# EAGLE design winder (EAGLE 7.3.0)
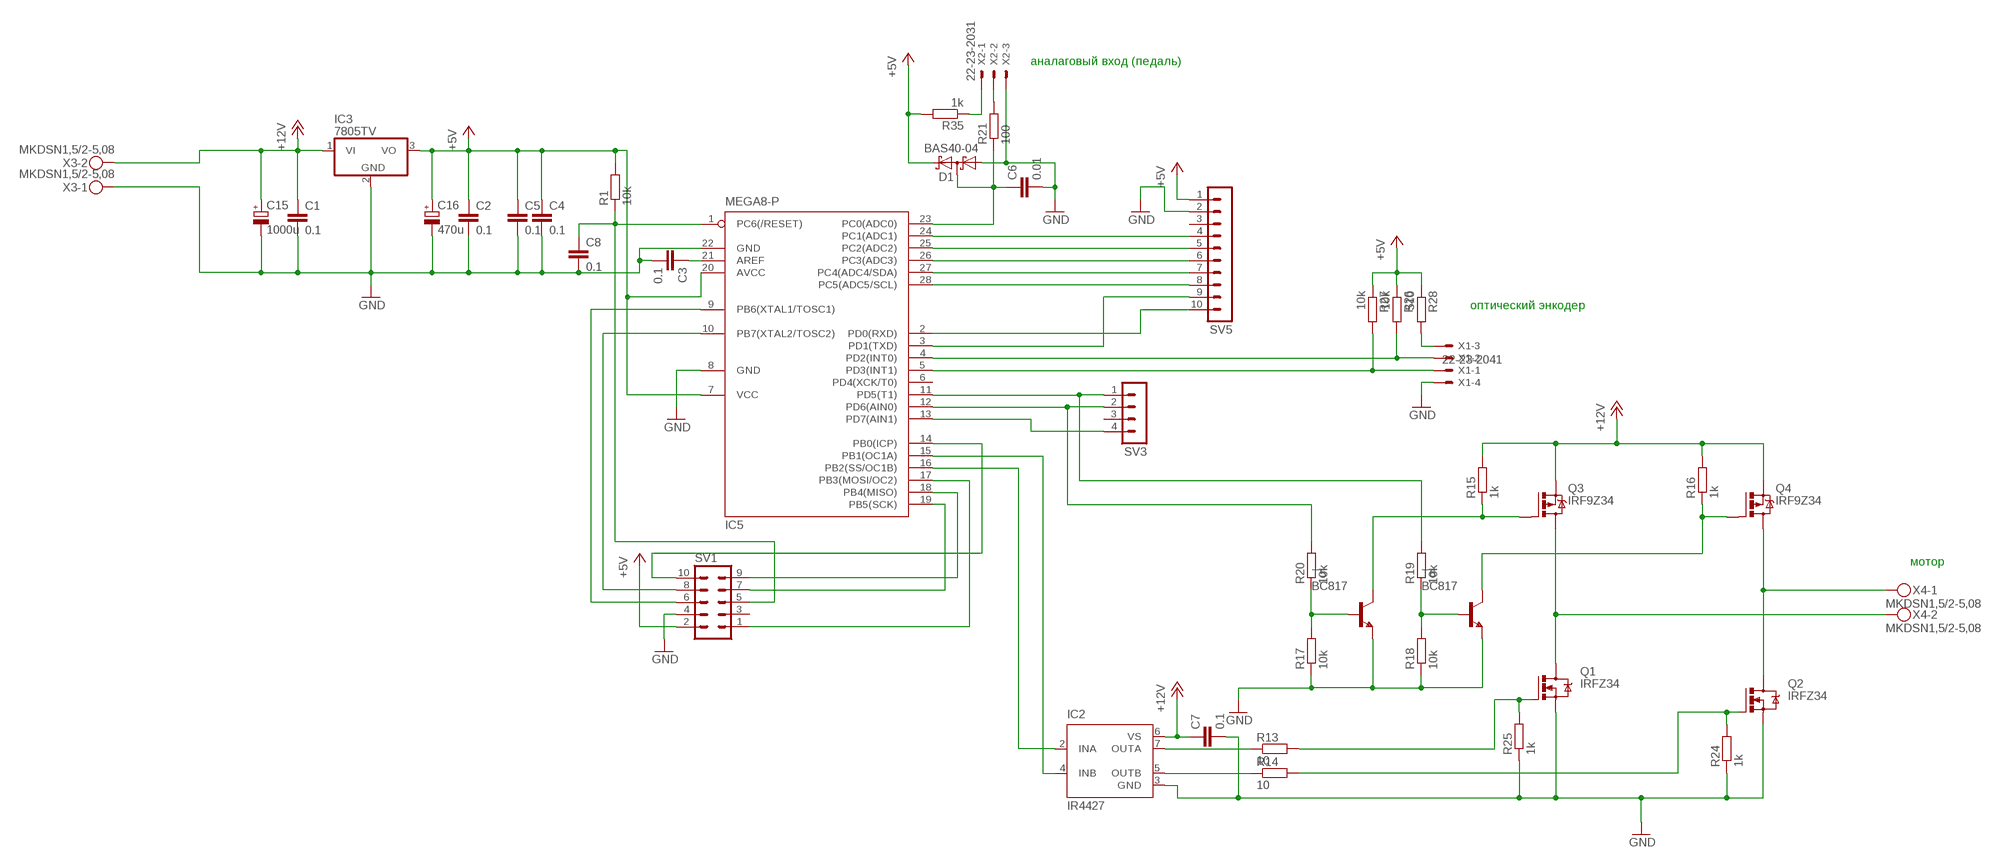
[diagram p0: schematic, sheet 1]

## Parts
C1  0.1  C-EUC0805  [C0805]
C2  0.1  C-EUC0805  [C0805]
C3  0.1  C-EUC0805  [C0805]
C4  0.1  C-EUC0805  [C0805]
C5  0.1  C-EUC0805  [C0805]
C6  0.01  C-EUC0805  [C0805]
C7  0.1  C-EUC0805  [C0805]
C8  0.1  C-EUC0805  [C0805]
C15  1000u  CPOL-EUE3.5-10  [E3,5-10]
C16  470u  CPOL-EUE3.5-10  [E3,5-10]
D1  BAS40-04  [SOT23]
IC2  IR4427  [DIL08]
IC3  7805TV  [TO220V]
IC5  MEGA8-P  [DIL28-3]
Q1  IRFZ34  IRF530  [TO220BV]
Q2  IRFZ34  IRF530  [TO220BV]
Q3  IRF9Z34  IRF9530  [TO220BV]
Q4  IRF9Z34  IRF9530  [TO220BV]
R1  10k  R-EU_R0805  [R0805]
R13  10  R-EU_R0805  [R0805]
R14  10  R-EU_R0805  [R0805]
R15  1k  R-EU_R0805  [R0805]
R16  1k  R-EU_R0805  [R0805]
R17  10k  R-EU_R0805  [R0805]
R18  10k  R-EU_R0805  [R0805]
R19  10k  R-EU_R0805  [R0805]
R20  10k  R-EU_R0805  [R0805]
R21  100  R-EU_R0805  [R0805]
R24  1k  R-EU_R0805  [R0805]
R25  1k  R-EU_R0805  [R0805]
R26  10k  R-EU_R0805  [R0805]
R27  10k  R-EU_R0805  [R0805]
R28  510  R-EU_R0805  [R0805]
R35  1k  R-EU_R0805  [R0805]
SV1  ML10  [ML10]
SV3  MA04-1  [MA04-1]
SV5  MA10-1  [MA10-1]
T5  BC817  BC817-16-NPN-SOT23-BEC  [SOT23-BEC]
T6  BC817  BC817-16-NPN-SOT23-BEC  [SOT23-BEC]
X1  22-23-2041  [22-23-2041]
X2  22-23-2031  [22-23-2031]
X3  MKDSN1,5/2-5,08  [MKDSN1,5/2-5,08]
X4  MKDSN1,5/2-5,08  [MKDSN1,5/2-5,08]

## Nets
+5V: C2.1 C4.1 C5.1 C16.+ D1.2(C2) IC3.3(VO) IC5.7(VCC) IC5.20(AVCC) R1.2 R26.1 R27.1 R28.1 R35.2 SV1.2 SV5.1
+12V: C1.1 C7.1 C15.+ IC2.6(VS) IC3.1(VI) Q3.S Q4.S R15.2 R16.2 X3.2
GND: C1.2 C2.2 C3.2 C4.2 C5.2 C6.2 C7.2 C8.2 C15.- C16.- D1.1(A1) IC2.3(GND) IC3.2(GND) IC5.8(GND) IC5.22(GND) Q1.S Q2.S R17.1 R18.1 R24.1 R25.1 SV1.4 SV5.2 T5.E T6.E X1.4 X2.3 X3.1
N$1: IC5.13(PD7(AIN1)) SV3.4
N$2: R28.2 X1.3
N$9: C6.1 D1.3(C1A2) IC5.23(PC0(ADC0)) R21.1
N$24: IC5.14(PB0(ICP)) SV1.10
N$25: IC5.5(PD3(INT1)) R27.2 X1.1
N$26: IC5.4(PD2(INT0)) R26.2 X1.2
N$28: IC5.28(PC5(ADC5/SCL)) SV5.8
N$29: IC5.27(PC4(ADC4/SDA)) SV5.7
N$32: Q4.G R16.1 T6.C
N$33: Q3.G R15.1 T5.C
N$34: R17.2 R20.1 T5.B
N$35: R18.2 R19.1 T6.B
N$36: R21.2 X2.2
N$37: Q1.D Q3.D X4.2
N$38: Q2.D Q4.D X4.1
N$39: Q1.G R13.2 R25.2
N$40: Q2.G R14.2 R24.2
N$41: IC2.7(OUTA) R13.1
N$42: IC2.5(OUTB) R14.1
N$43: IC2.4(INB) IC5.15(PB1(OC1A))
N$44: IC5.10(PB7(XTAL2/TOSC2)) SV1.8
N$45: IC5.17(PB3(MOSI/OC2)) SV1.1
N$46: C8.1 IC5.1(PC6(/RESET)) R1.1 SV1.5
N$47: R35.1 X2.1
N$48: IC5.19(PB5(SCK)) SV1.7
N$49: IC5.18(PB4(MISO)) SV1.9
N$52: C3.1 IC5.21(AREF)
N$56: IC5.11(PD5(T1)) R19.2 SV3.1
N$57: IC5.12(PD6(AIN0)) R20.2 SV3.2
N$58: IC5.26(PC3(ADC3)) SV5.6
N$59: IC5.25(PC2(ADC2)) SV5.5
N$60: IC5.3(PD1(TXD)) SV5.9
N$61: IC5.9(PB6(XTAL1/TOSC1)) SV1.6
N$62: IC5.2(PD0(RXD)) SV5.10
N$71: IC5.24(PC1(ADC1)) SV5.4
N$76: IC2.2(INA) IC5.16(PB2(SS/OC1B))
Unconnected: IC5.6(PD4(XCK/T0)) SV1.3 SV3.3 SV5.3

## Notes on the sheet
- аналаговый вход (педаль)
- оптический энкодер
- мотор

## Library data of the parts
C1-C8 = rcl:C-EU: CAPACITOR, European symbol
C15 C16 = rcl:CPOL-EU: POLARIZED CAPACITOR, European symbol
D1 = diode:BAS40-04: Silicon Schottky Diodes General-purpose diode for high-speed switching
IC2 = ir:IR4427: DUAL LOW SIDE DRIVER Source: ID4426.pdf; MF: INTERNATIONAL RECTIFIER(IR); MPN: IR4427; OC_FARNELL: 1023267; OC_NEWARK: 27C6914
IC3 = linear:78*: Positive VOLTAGE REGULATOR Source: http://cache.national.com/ds/LM/LM78L05.pdf http://www.fairchildsemi.com/ds/LM/LM7805.pdf
IC5 = atmel:MEGA8-P: MICROCONTROLLER 8 Kbytes FLASH, 1 kbytes SRAM, 512 bytes EEPROM, USART, 4-channel 10 bit ADC, 2-channel 8 bit ADC Pin compatible with Atmega48, ATMega88, ATMega168 Source: avr.lbr; OC_FARNELL: unknown; OC_NEWARK: unknown
Q1 Q2 = transistor-power:IRF530: HEXFET Power MOSFET
Q3 Q4 = transistor-power:IRF9530: P-CHANNEL HEXFET POWER-MOS-FET Source: http://www.irf.com/product-info/datasheets/data/irf9530.pdf
R1 R13-R21 R24-R28 R35 = rcl:R-EU_: RESISTOR, European symbol
SV1 = con-ml:ML10: HARTING; OC_FARNELL: unknown; OC_NEWARK: unknown
SV3 = con-lstb:MA04-1: PIN HEADER; OC_FARNELL: unknown; OC_NEWARK: unknown
SV5 = con-lstb:MA10-1: PIN HEADER; OC_FARNELL: unknown; OC_NEWARK: unknown
T5 T6 = transistor:*-NPN-: NPN Transistror BF959 corrected 2008.03.06
X1 = con-molex:22-23-2041: .100" (2.54mm) Center Header - 4 Pin; MF: MOLEX; MPN: 22-23-2041; OC_FARNELL: 1462920; OC_NEWARK: 38C0355
X2 = con-molex:22-23-2031: .100" (2.54mm) Center Header - 3 Pin; MF: MOLEX; MPN: 22-23-2031; OC_FARNELL: 1462950; OC_NEWARK: 30C0862
X3 X4 = con-phoenix-508:MKDSN1,5/2-5,08: MKDSN 1,5/ 2-5,08 Printklemme Nennstrom: 13,5 A Nennspannung: 250 V Rastermaß: 5,08 mm Polzahl: 2 Anschlussart: Schraubanschluss Montage: Löten Anschlussrichtung Leiter/Platine: 0 ° Artikelnummer: 1729128 Source: http://eshop.phoenixcontact.com .. 1729128.pdf

## Board
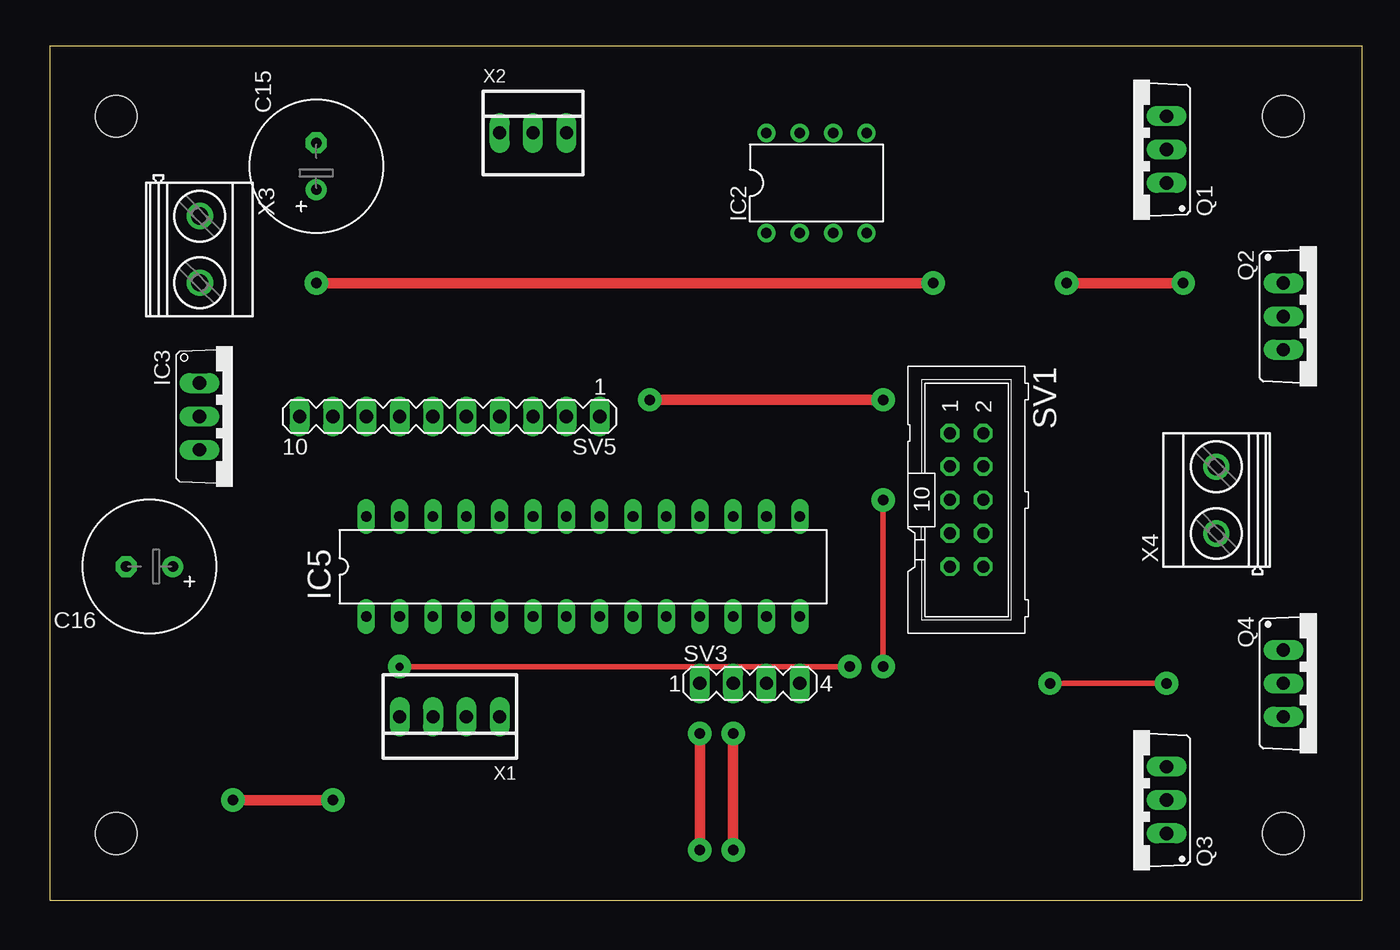
[diagram p1: board, top side]
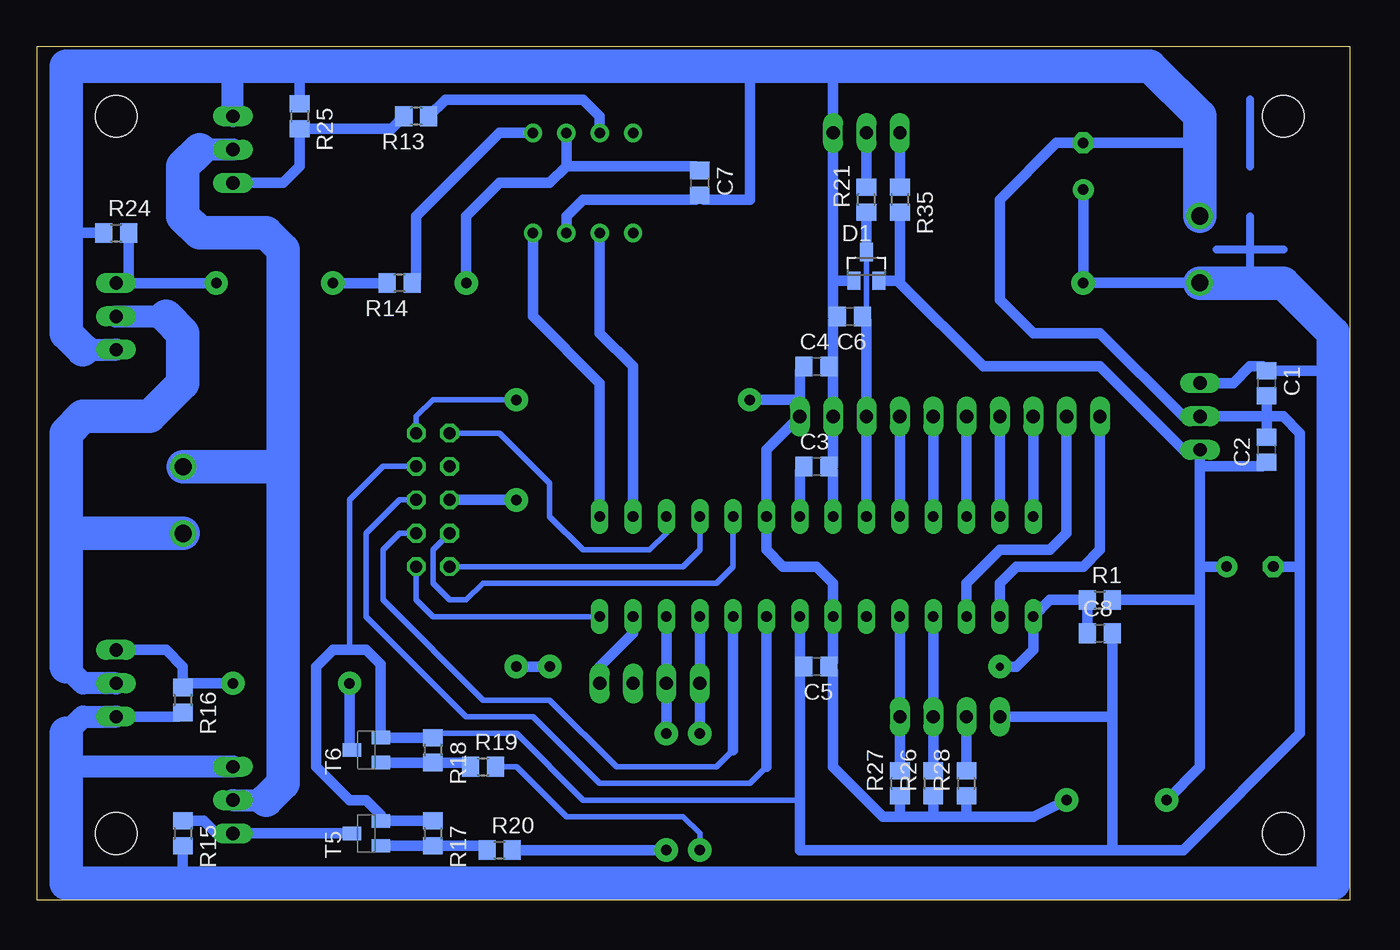
[diagram p2: board, bottom side, seen from below]

Size 100 x 65 mm. Coordinates in mm from the lower left corner, seen from the top.
Outline: 0,0 100,0 100,65 0,65 0,0
Copper layers (1*16): Top 0.035mm / dielectric 1.5mm / Bottom 0.035mm
Design rules "default": minimum track width 10mil, minimum drill 24mil, track to track 8mil, track to pad 8mil, pad to pad 8mil, via to via 8mil, smd to smd 8mil, copper to edge 40mil, drill to drill 8mil, minimum pad ring 10mil, minimum via ring 8mil, stop-mask expansion 4mil, vias tented up to drill 0mil, thermal gap 10mil
Holes 3.2 mm at 5.08,59.69 5.08,5.08 93.98,5.08 93.98,59.69

### Footprints (pad centres in the part's own frame; a part is rotated, then mirrored left to right if it is on the bottom)
C0805 = smd 1.3 x 1.5: 1 -0.95,0; 2 0.95,0
E3,5-10 = drill 0.813 pad 1.6: + -1.778,0 | drill 0.813 pad 1.6 octagon: - 1.778,0
SOT23 = smd 1 x 1.4: 1 -0.95,-1.1; 2 0.95,-1.1; 3 0,1.1
DIL08 = drill 0.8 pad 1.4: 1 -3.81,-3.81; 2 -1.27,-3.81; 3 1.27,-3.81; 4 3.81,-3.81; 5 3.81,3.81; 6 1.27,3.81; 7 -1.27,3.81; 8 -3.81,3.81
TO220V = drill 1.016 long: 1 -2.54,-2.54; 2 0,-2.54; 3 2.54,-2.54
DIL28-3 = drill 0.813 long: 1 -16.51,-3.81; 2 -13.97,-3.81; 3 -11.43,-3.81; 4 -8.89,-3.81; 5 -6.35,-3.81; 6 -3.81,-3.81; 7 -1.27,-3.81; 8 1.27,-3.81; 9 3.81,-3.81; 10 6.35,-3.81; 11 8.89,-3.81; 12 11.43,-3.81; 13 13.97,-3.81; 14 16.51,-3.81; 15 16.51,3.81; 16 13.97,3.81; 17 11.43,3.81; 18 8.89,3.81; 19 6.35,3.81; 20 3.81,3.81; 21 1.27,3.81; 22 -1.27,3.81; 23 -3.81,3.81; 24 -6.35,3.81; 25 -8.89,3.81; 26 -11.43,3.81; 27 -13.97,3.81; 28 -16.51,3.81
TO220BV = drill 1.016 long: D 0,-2.54; G -2.54,-2.54; S 2.54,-2.54
R0805 = smd 1.3 x 1.5: 1 -0.95,0; 2 0.95,0
ML10 = drill 0.914 octagon: 1 -5.08,-1.27; 2 -5.08,1.27; 3 -2.54,-1.27; 4 -2.54,1.27; 5 0,-1.27; 6 0,1.27; 7 2.54,-1.27; 8 2.54,1.27; 9 5.08,-1.27; 10 5.08,1.27
MA04-1 = drill 1.016 long: 1 -3.81,0; 2 -1.27,0; 3 1.27,0; 4 3.81,0
MA10-1 = drill 1.016 long: 1 -11.43,0; 2 -8.89,0; 3 -6.35,0; 4 -3.81,0; 5 -1.27,0; 6 1.27,0; 7 3.81,0; 8 6.35,0; 9 8.89,0; 10 11.43,0
SOT23-BEC = smd 1 x 1.4: B -0.95,-1.1; C 0,1.1; E 0.95,-1.1
22-23-2041 = drill 1 long: 1 -3.81,0; 2 -1.27,0; 3 1.27,0; 4 3.81,0
22-23-2031 = drill 1 long: 1 -2.54,0; 2 0,0; 3 2.54,0
MKDSN1,5/2-5,08 = drill 1.3 pad 2: 1 -2.561,0.025; 2 2.519,0.025

### Placement (x,y rotation side)
C1  6.35,39.37 270 bottom
C2  6.35,34.29 90 bottom
C3  40.64,33.02 0 bottom
C4  40.64,40.64 0 bottom
C5  40.64,17.78 180 bottom
C6  38.1,44.45 180 bottom
C7  49.53,54.61 270 bottom
C8  19.05,20.32 0 bottom
C15  20.32,55.88 90 top
C16  7.62,25.4 180 top
D1  36.83,48.26 0 bottom
IC2  58.42,54.61 0 top
IC3  13.97,36.83 270 top
IC5  40.64,25.4 0 top
Q1  82.55,57.15 90 top
Q2  96.52,44.45 270 top
Q3  82.55,7.62 90 top
Q4  96.52,16.51 270 top
R1  19.05,22.86 0 bottom
R13  71.12,59.69 180 bottom
R14  72.39,46.99 180 bottom
R15  88.9,5.08 270 bottom
R16  88.9,15.24 270 bottom
R17  69.85,5.08 270 bottom
R18  69.85,11.43 270 bottom
R19  66.04,10.16 0 bottom
R20  64.77,3.81 0 bottom
R21  36.83,53.34 90 bottom
R24  93.98,50.8 0 bottom
R25  80.01,59.69 270 bottom
R26  31.75,8.89 90 bottom
R27  34.29,8.89 90 bottom
R28  29.21,8.89 90 bottom
R35  34.29,53.34 270 bottom
SV1  69.85,30.48 270 top
SV3  53.34,16.51 0 top
SV5  30.48,36.83 180 top
T5  74.93,5.08 90 bottom
T6  74.93,11.43 90 bottom
X1  30.48,13.97 180 top
X2  36.83,58.42 0 top
X3  11.43,49.53 270 top
X4  88.9,30.48 90 top

### Tracks (layer width: path | path; a pad name or v marks a point on that pad's centre or on a via)
+5V  (via drill 0.8 pad 1.78)
  Top 0.813: v63.5,38.1 v45.72,38.1 | v21.59,7.62 v13.97,7.62
  Bottom 0.406: 6.67,33.02 C2.1 | 34.46,47.16 34.29,46.99 | SV1.2 71.12,36.83 69.85,38.1 v63.5,38.1
  Bottom 0.813: R27.1 34.29,6.35 | 34.29,6.35 31.75,6.35 | 31.75,6.35 29.21,6.35 | R28.1 29.21,6.35 | R26.1 31.75,6.35 | 11.43,33.02 6.67,33.02 | 34.29,6.35 35.56,6.35 39.37,10.16 39.37,17.46 C5.1 39.37,18.1 IC5.7 39.37,24.13 40.64,25.4 43.18,25.4 44.45,26.67 IC5.20 44.45,34.29 SV5.1 41.91,38.1 | R1.2 11.43,22.86 | 41.91,38.1 41.91,40.32 C4.1 | R35.2 34.29,46.99 27.94,40.64 19.05,40.64 12.7,34.29 IC3.3 11.43,33.02 | D1.2 34.46,47.16 | v45.72,38.1 41.91,38.1 | C16.+ 11.43,25.4 | 29.21,6.35 24.13,6.35 v21.59,7.62 | v13.97,7.62 11.43,10.16 11.43,22.86 | 11.43,22.86 11.43,25.4 | 11.43,25.4 11.43,33.02
+12V  (via drill 0.8 pad 1.78)
  Top 0.813: v20.32,46.99 v67.31,46.99
  Bottom 0.406: 49.85,55.88 C7.1 | 6.67,40.64 C1.1 | 89.22,13.97 R16.2 | 1.59,40.32 1.27,40.64 | 20.3,47.01 v20.32,46.99
  Bottom 0.61: 7.62,52.07 7.62,46.99
  Bottom 0.813: 59.69,55.88 49.85,55.88 | IC3.1 8.89,39.37 7.62,40.64 6.67,40.64 | v67.31,46.99 67.31,52.07 64.77,54.61 60.96,54.61 59.69,55.88 | R15.2 88.9,1.27 | Q4.S 89.22,13.97 | IC2.6 59.69,55.88 | C1.1 1.59,40.32 | X3.2 20.3,47.01 | C15.+ v20.32,46.99
  Bottom 1.27: 11.43,46.99 X3.2
  Bottom 1.676: 97.79,12.7 96.52,13.97 Q4.S | Q3.S 97.79,10.16
  Bottom 2.54: 11.43,46.99 7.62,46.99 5.08,46.99 1.27,43.18 1.27,40.64 1.27,1.27 88.9,1.27 97.79,1.27 97.79,10.16 97.79,12.7
GND
  Bottom 0.406: IC5.8 41.91,18.1 | SV1.4 73.66,33.02 76.2,30.48 76.2,19.05 | 49.85,53.34 C7.2 49.21,53.34 | 6.03,35.56 C2.2 | 12.7,36.83 IC3.2 | 39.2,47.16 39.37,46.99 | 41.91,7.62 58.42,7.62 63.5,12.7 69.53,12.7 R18.1 | 11.96,57.66 11.46,57.15 | 18.1,4.13 17.78,3.81 | C6.2 39.37,44.45 39.37,44.13 C6.2
  Bottom 0.813: R17.1 T5.E 73.83,6.52 74.93,7.62 76.2,7.62 78.74,10.16 78.74,17.78 77.47,19.05 76.2,19.05 74.93,19.05 73.83,17.95 T6.E R18.1 | R25.1 80.01,63.5 | IC2.3 59.69,52.07 58.42,53.34 49.85,53.34 | 49.21,53.34 45.72,53.34 45.72,63.5 | IC5.8 41.91,17.78 | 41.91,17.78 41.91,7.62 41.91,3.81 17.78,3.81 12.7,3.81 3.81,12.7 3.81,25.4 | C1.2 6.35,36.83 | 6.35,36.83 C2.2 | IC3.2 6.35,36.83 | 12.7,36.83 19.05,43.18 24.13,43.18 26.67,45.72 26.67,53.34 22.35,57.66 C15.- 11.96,57.66 | 39.37,44.45 39.37,46.99 X2.3 39.37,63.5 | D1.1 39.2,47.16 | 39.37,40.64 SV5.2 39.37,33.02 C3.2 39.37,32.7 IC5.22 | 39.37,40.64 39.37,44.13 | R24.1 97.79,50.8 | 6.35,36.83 5.08,36.83 3.81,35.56 3.81,25.4 | C16.- 3.81,25.4 | X1.4 18.1,13.97 | 18.1,13.97 18.1,4.13 | C4.2 39.37,40.64 | C5.2 41.91,17.78 | C8.2 18.1,13.97
  Bottom 1.676: 96.52,41.91 Q2.S | Q1.S 85.09,63.5
  Bottom 2.54: X3.1 11.46,57.15 11.46,59.72 15.24,63.5 39.37,63.5 45.72,63.5 80.01,63.5 85.09,63.5 97.79,63.5 97.79,50.8 97.79,43.18 96.52,41.91
N$1
  Bottom 0.813: IC5.13 54.61,20.32 57.15,17.78 SV3.4
N$2
  Bottom 0.813: R28.2 X1.3
N$3
  Bottom 0.61: 5.08,49.53 10.16,49.53
N$4
  Bottom 0.61: 7.62,60.96 7.62,55.88
N$9
  Bottom 0.406: D1.3 36.83,44.77 C6.1
  Bottom 0.813: R21.1 D1.3 | IC5.23 36.83,44.13 C6.1
N$24
  Bottom 0.406: IC5.14 69.85,21.59 71.12,22.86 SV1.10
N$25
  Bottom 0.813: IC5.5 X1.1 R27.2
N$26
  Bottom 0.813: IC5.4 X1.2 R26.2
N$28
  Bottom 0.813: IC5.28 SV5.8
N$29
  Bottom 0.813: SV5.7 IC5.27
N$32  (via drill 0.8 pad 1.78)
  Top 0.406: v85.09,16.51 v76.2,16.51
  Bottom 0.406: 88.58,16.51 R16.1 | 76.2,11.6 T6.C
  Bottom 0.813: v85.09,16.51 88.58,16.51 | Q4.G 90.17,19.05 88.9,17.78 R16.1 | v76.2,16.51 76.2,11.6
N$33
  Bottom 0.813: T5.C Q3.G 86.36,5.08 87.31,6.03 R15.1
N$34
  Bottom 0.406: 66.04,4.13 R20.1
  Bottom 0.813: T5.B R17.2 66.04,4.13
N$35
  Bottom 0.406: 67.31,10.48 R19.1
  Bottom 0.813: T6.B R18.2 67.31,10.48
N$36
  Bottom 0.813: X2.2 R21.2
N$37
  Bottom 1.27: 81.3,33 81.28,33.02
  Bottom 1.676: Q3.D 82.55,7.62 | Q1.D 87.63,57.15
  Bottom 2.54: 82.55,7.62 81.28,8.89 81.28,33.02 81.28,49.53 82.55,50.8 87.63,50.8 88.9,52.07 88.9,55.88 87.63,57.15 | X4.2 81.3,33
N$38
  Bottom 1.27: 97.77,27.92 97.79,27.94
  Bottom 1.676: Q4.D 96.52,16.51 97.79,17.78 | Q2.D 90.17,44.45
  Bottom 2.54: 97.79,17.78 97.79,27.94 97.79,35.56 96.52,36.83 91.44,36.83 88.9,39.37 88.9,43.18 90.17,44.45 | X4.1 97.77,27.92
N$39
  Bottom 0.813: Q1.G 81.28,54.61 80.01,55.88 R25.2 73.02,58.74 R13.2
N$40  (via drill 0.8 pad 1.78)
  Top 0.813: v86.36,46.99 v77.47,46.99
  Bottom 0.406: 93.03,47.31 92.71,46.99
  Bottom 0.813: v77.47,46.99 R14.2 | v86.36,46.99 92.71,46.99 Q2.G | R24.2 93.03,47.31
N$41
  Bottom 0.813: IC2.7 57.15,59.69 58.42,60.96 68.9,60.96 R13.1
N$42
  Bottom 0.406: 71.12,47.31 R14.1
  Bottom 0.813: IC2.5 64.77,58.42 71.12,52.07 71.12,47.31
N$43
  Bottom 0.813: IC2.4 62.23,44.45 57.15,39.37 IC5.15
N$44
  Bottom 0.406: 46.99,11.43 48.26,10.16 55.88,10.16 60.96,15.24 66.04,15.24 73.66,22.86 73.66,26.67 72.39,27.94 SV1.8
  Bottom 0.813: IC5.10 46.99,11.43
N$45
  Bottom 0.406: IC5.17 52.07,27.94 53.34,26.67 58.42,26.67 60.96,29.21 60.96,31.75 64.77,35.56 SV1.1
N$46  (via drill 0.6 pad 1.78, 0.8 pad 1.78)
  Top 0.406: v63.5,30.48 v63.5,17.78 | v26.67,17.78 v60.96,17.78
  Bottom 0.813: SV1.5 v63.5,30.48 | C8.1 R1.1 22.86,22.86 IC5.1 24.13,19.05 25.4,17.78 v26.67,17.78 | v60.96,17.78 v63.5,17.78
N$47
  Bottom 0.813: X2.1 R35.1
N$48
  Bottom 0.406: IC5.19 46.99,25.4 48.26,24.13 66.04,24.13 67.31,22.86 68.58,22.86 69.85,24.13 69.85,26.67 SV1.7
N$49
  Bottom 0.406: IC5.18 49.53,26.67 50.8,25.4 SV1.9
N$52
  Bottom 0.406: 41.91,32.7 C3.1
  Bottom 0.813: IC5.21 41.91,32.7
N$56  (via drill 0.8 pad 1.78)
  Top 0.813: v49.53,12.7 v49.53,3.81
  Bottom 0.406: v49.53,3.81 49.53,5.08 50.8,6.35 59.69,6.35 63.5,10.16 R19.2
  Bottom 0.813: IC5.11 SV3.1 v49.53,12.7
N$57  (via drill 0.8 pad 1.78)
  Top 0.813: v52.07,12.7 v52.07,3.81
  Bottom 0.813: IC5.12 SV3.2 v52.07,12.7 | v52.07,3.81 R20.2
N$58
  Bottom 0.813: IC5.26 SV5.6
N$59
  Bottom 0.813: SV5.5 IC5.25
N$60
  Bottom 0.813: IC5.3 29.21,24.13 26.67,26.67 22.86,26.67 21.59,27.94 SV5.9
N$61
  Bottom 0.406: SV1.6 72.39,30.48 74.93,27.94 74.93,21.59 67.31,13.97 62.23,13.97 57.15,8.89 45.72,8.89 44.45,10.16
  Bottom 0.813: IC5.9 44.45,10.16
N$62
  Bottom 0.813: SV5.10 19.05,26.67 20.32,25.4 25.4,25.4 26.67,24.13 IC5.2
N$71
  Bottom 0.813: IC5.24 SV5.4
N$76
  Bottom 0.813: IC5.16 54.61,40.64 57.15,43.18 IC2.2